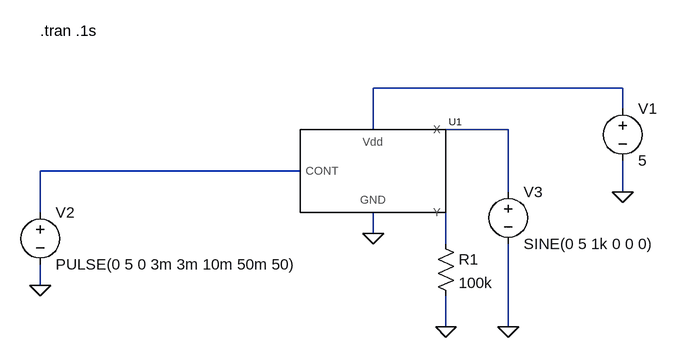
[diagram p0: schematic analogsw.asc]
analogsw.asc, the LTspice schematic file:
Version 4
SHEET 1 880 680
WIRE 544 0 160 0
WIRE 544 32 544 0
WIRE 160 64 160 0
WIRE 368 64 272 64
WIRE 48 128 -352 128
WIRE 368 160 368 64
WIRE 544 160 544 112
WIRE -352 192 -352 128
WIRE 160 224 160 192
WIRE 272 240 272 192
WIRE -352 304 -352 272
WIRE 272 368 272 320
WIRE 368 368 368 240
FLAG 544 160 0
FLAG -352 304 0
FLAG 272 368 0
FLAG 368 368 0
FLAG 160 224 0
SYMBOL Misc\\analogsw 176 144 R0
SYMATTR ModelFile analogsw.sub
SYMATTR InstName U1
SYMBOL voltage 544 16 R0
WINDOW 123 0 0 Left 0
WINDOW 39 0 0 Left 0
SYMATTR InstName V1
SYMATTR Value 5
SYMBOL voltage -352 176 R0
WINDOW 123 0 0 Left 0
WINDOW 39 0 0 Left 0
SYMATTR InstName V2
SYMATTR Value PULSE(0 5 0 3m 3m 10m 50m 50)
SYMBOL res 256 224 R0
SYMATTR InstName R1
SYMATTR Value 100k
SYMBOL voltage 368 144 R0
WINDOW 123 0 0 Left 0
WINDOW 39 0 0 Left 0
SYMATTR InstName V3
SYMATTR Value SINE(0 5 1k 0 0 0)
TEXT -352 -88 Left 0 !.tran .1s

The netlist it stands for:
* analogsw.asc
XU1 N002 N004 N003 N001 0 analogsw  ; pins X Y CONT Vdd GND
V1 N001 0 5
V2 N003 0 PULSE(0 5 0 3m 3m 10m 50m 50)
R1 N004 0 100k
V3 N002 0 SINE(0 5 1k 0 0 0)
.tran .1s
.lib analogsw.sub
.backanno
.end